# Altium schematic sheet TOP_VOLTAGE.SchDoc
size A3
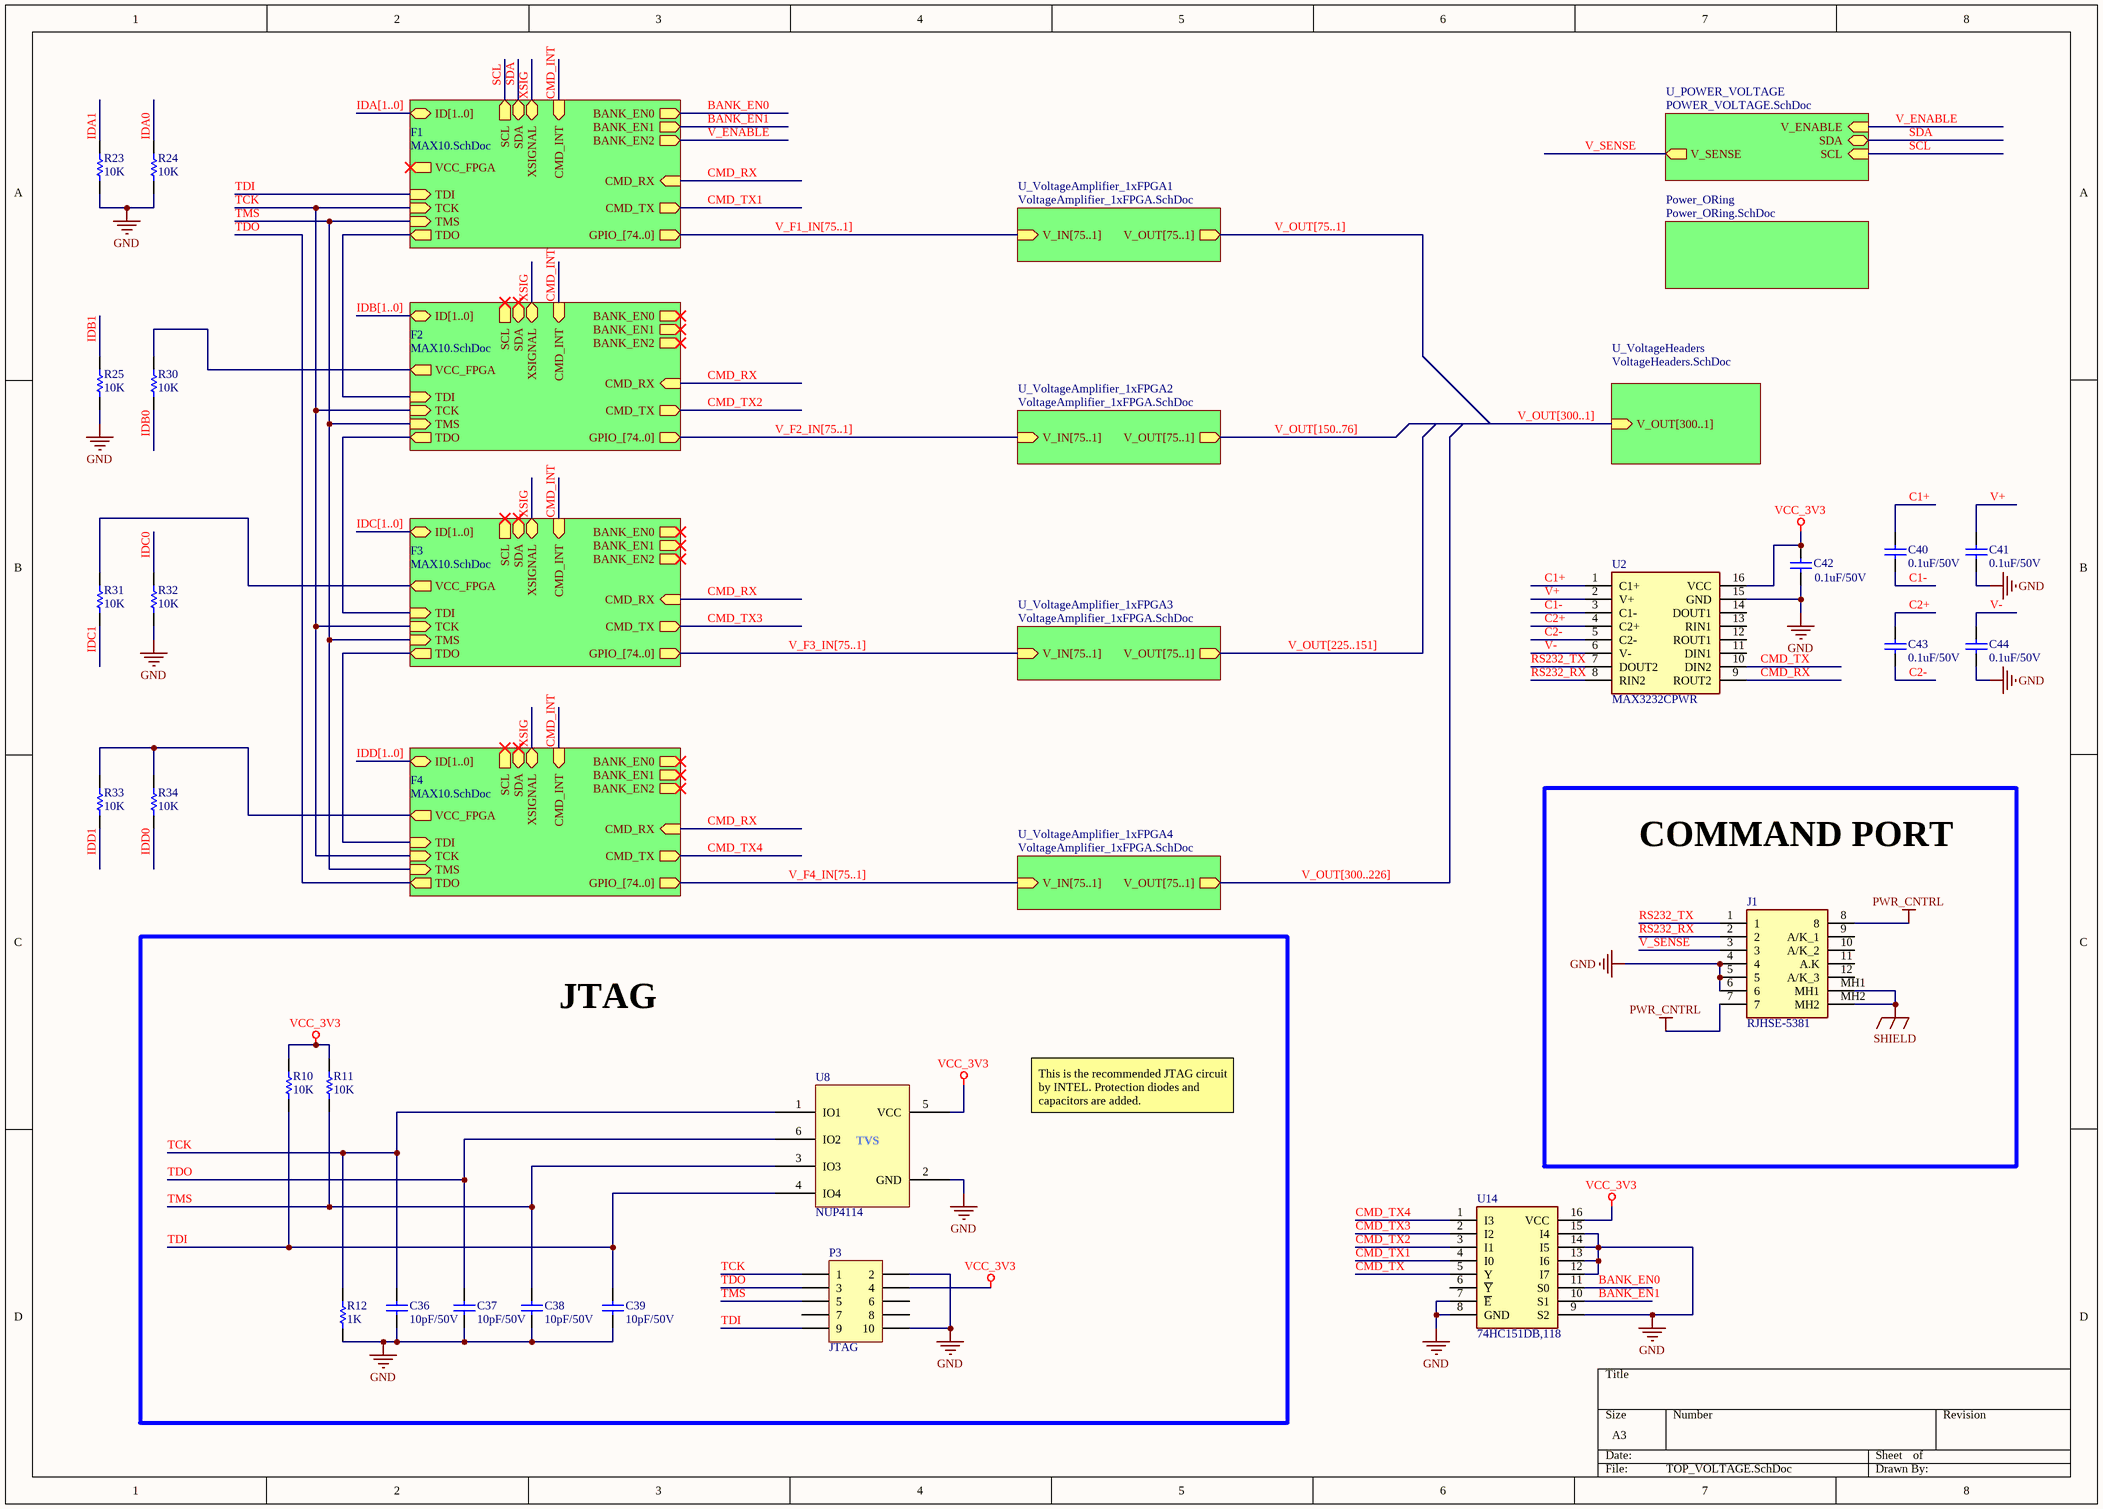
[diagram p0: TOP_VOLTAGE.SchDoc]

## Parts
C36  10pF/50V  [0603C]
C37  10pF/50V  [0603C]
C38  10pF/50V  [0603C]
C39  10pF/50V  [0603C]
C40  0.1uF/50V  [0603C]
C41  0.1uF/50V  [0603C]
C42  0.1uF/50V  [0603C]
C43  0.1uF/50V  [0603C]
C44  0.1uF/50V  [0603C]
J1  RJHSE-5381  [RJHSE5381]
P3  JTAG  [HDR2X5]  (no BOM)
R10  10K  [0603R]
R11  10K  [0603R]
R12  1K  [0603R]
R23  10K  [0603R]
R24  10K  [0603R]
R25  10K  [0603R]
R30  10K  [0603R]
R31  10K  [0603R]
R32  10K  [0603R]
R33  10K  [0603R]
R34  10K  [0603R]
U2  MAX3232CPWR  [MAX3232CPWR]
U8  NUP4114  [NUP4114HMR6T1G]
U14  74HC151DB,118  [74HC151DB,118]

## Blocks framed on the sheet
COMMAND PORT: J1
JTAG: C36-C39 P3 R10-R12 U8

## Sub-sheets
F1 = MAX10.SchDoc: TDI (in), TCK (in), TMS (in), TDO (out), CMD_RX (in), CMD_TX (out), SDA (bidir), CMD_INT (in), BANK_EN2 (out), GPIO_[74..0] (out), XSIGNAL (bidir), SCL (out), BANK_EN0 (out), BANK_EN1 (out), ID[1..0] (bidir), VCC_FPGA (out)
F2 = MAX10.SchDoc: TDI (in), TCK (in), TMS (in), TDO (out), CMD_RX (in), CMD_TX (out), SDA (bidir), CMD_INT (in), BANK_EN2 (out), GPIO_[74..0] (out), XSIGNAL (bidir), SCL (out), BANK_EN0 (out), BANK_EN1 (out), ID[1..0] (bidir), VCC_FPGA (out)
F3 = MAX10.SchDoc: TDI (in), TCK (in), TMS (in), TDO (out), CMD_RX (in), CMD_TX (out), SDA (bidir), CMD_INT (in), BANK_EN2 (out), GPIO_[74..0] (out), XSIGNAL (bidir), SCL (out), BANK_EN0 (out), BANK_EN1 (out), ID[1..0] (bidir), VCC_FPGA (out)
F4 = MAX10.SchDoc: TDI (in), TCK (in), TMS (in), TDO (out), CMD_RX (in), CMD_TX (out), SDA (bidir), CMD_INT (in), BANK_EN2 (out), GPIO_[74..0] (out), XSIGNAL (bidir), SCL (out), BANK_EN0 (out), BANK_EN1 (out), ID[1..0] (bidir), VCC_FPGA (out)
Power_ORing = Power_ORing.SchDoc: no entries
U_POWER_VOLTAGE = POWER_VOLTAGE.SchDoc: V_SENSE (out), V_ENABLE (in), SDA (bidir), SCL (in)
U_VoltageAmplifier_1xFPGA1 = VoltageAmplifier_1xFPGA.SchDoc: V_IN[75..1] (in), V_OUT[75..1] (out)
U_VoltageAmplifier_1xFPGA2 = VoltageAmplifier_1xFPGA.SchDoc: V_IN[75..1] (in), V_OUT[75..1] (out)
U_VoltageAmplifier_1xFPGA3 = VoltageAmplifier_1xFPGA.SchDoc: V_IN[75..1] (in), V_OUT[75..1] (out)
U_VoltageAmplifier_1xFPGA4 = VoltageAmplifier_1xFPGA.SchDoc: V_IN[75..1] (in), V_OUT[75..1] (out)
U_VoltageHeaders = VoltageHeaders.SchDoc: V_OUT[300..1] (in)

## Nets
GND: C36.1 C37.1 C38.1 C39.1 C41.1 C42.1 C44.1 J1.4 J1.5 J1.6 P3.2 P3.10 R12.1 R23.2 R24.2 R25.2 R32.2 U2.15(GND) U8.2(GND) U14.7(~{E}) U14.8(GND) U14.9(S2) U14.12(I7) U14.13(I6) U14.14(I5) U14.15(I4)
PWR_CNTRL: J1.7 J1.8
SHIELD: J1.MH1 J1.MH2
VCC_3V3: C42.2 P3.4 R10.1 R11.1 U2.16(VCC) U8.5(VCC) U14.16(VCC)
BANK_EN0: U14.11(S0) ; sheet F1/BANK_EN0
BANK_EN1: U14.10(S1) ; sheet F1/BANK_EN1
C1+: C40.2 U2.1(C1+)
C1-: C40.1 U2.3(C1-)
C2+: C43.2 U2.4(C2+)
C2-: C43.1 U2.5(C2-)
CMD_INT: sheet F1/CMD_INT, sheet F2/CMD_INT, sheet F3/CMD_INT, sheet F4/CMD_INT
CMD_RX: U2.9(ROUT2) ; sheet F1/CMD_RX, sheet F2/CMD_RX, sheet F3/CMD_RX, sheet F4/CMD_RX
CMD_TX: U2.10(DIN2) U14.5(Y)
CMD_TX1: U14.4(I0) ; sheet F1/CMD_TX
CMD_TX2: U14.3(I1) ; sheet F2/CMD_TX
CMD_TX3: U14.2(I2) ; sheet F3/CMD_TX
CMD_TX4: U14.1(I3) ; sheet F4/CMD_TX
IDA0: R24.1
IDA1: R23.1
IDB0: R30.2
IDB1: R25.1
IDC0: R32.1
IDC1: R31.2
IDD0: R34.2
IDD1: R33.2
RS232_RX: J1.2 U2.8(RIN2)
RS232_TX: J1.1 U2.7(DOUT2)
SCL: sheet F1/SCL, sheet U_POWER_VOLTAGE/SCL
SDA: sheet F1/SDA, sheet U_POWER_VOLTAGE/SDA
TCK: C36.2 P3.1 R12.2 U8.1(IO1) ; sheet F1/TCK, sheet F2/TCK, sheet F3/TCK, sheet F4/TCK
TDI: C39.2 P3.9 R10.2 U8.4(IO4) ; sheet F1/TDI
TDO: C37.2 P3.3 U8.6(IO2) ; sheet F4/TDO
TMS: C38.2 P3.5 R11.2 U8.3(IO3) ; sheet F1/TMS, sheet F2/TMS, sheet F3/TMS, sheet F4/TMS
V+: C41.2 U2.2(V+)
V-: C44.2 U2.6(V-)
V_ENABLE: sheet F1/BANK_EN2, sheet U_POWER_VOLTAGE/V_ENABLE
V_SENSE: J1.3 ; sheet U_POWER_VOLTAGE/V_SENSE
XSIG: sheet F1/XSIGNAL, sheet F2/XSIGNAL, sheet F3/XSIGNAL, sheet F4/XSIGNAL
NetR30_1: R30.1 ; sheet F2/VCC_FPGA
NetR31_1: R31.1 ; sheet F3/VCC_FPGA
NetR33_1: R33.1 R34.1 ; sheet F4/VCC_FPGA
(unnamed): sheet F1/TDO, sheet F2/TDI
(unnamed): sheet F2/TDO, sheet F3/TDI
(unnamed): sheet F3/TDO, sheet F4/TDI

Not connected (* = marked no-connect by the designer): J1 9(A/K_1) 10(A/K_2) 11(A.K) 12(A/K_3); P3 6 7 8; U2 11(DIN1) 12(ROUT1) 13(RIN1) 14(DOUT1); U14 6(~{Y})

## Buses and harness runs
bus IDA[1..0] = sheet F1/ID[1..0]
bus IDB[1..0] = sheet F2/ID[1..0]
bus IDC[1..0] = sheet F3/ID[1..0]
bus IDD[1..0] = sheet F4/ID[1..0]
bus V_F1_IN[75..1] = sheet F1/GPIO_[74..0] = sheet U_VoltageAmplifier_1xFPGA1/V_IN[75..1]
bus V_F2_IN[75..1] = sheet F2/GPIO_[74..0] = sheet U_VoltageAmplifier_1xFPGA2/V_IN[75..1]
bus V_F3_IN[75..1] = sheet F3/GPIO_[74..0] = sheet U_VoltageAmplifier_1xFPGA3/V_IN[75..1]
bus V_F4_IN[75..1] = sheet F4/GPIO_[74..0] = sheet U_VoltageAmplifier_1xFPGA4/V_IN[75..1]
bus V_OUT[75..1] = sheet U_VoltageAmplifier_1xFPGA1/V_OUT[75..1]
bus V_OUT[150..76] = sheet U_VoltageAmplifier_1xFPGA2/V_OUT[75..1]
bus V_OUT[225..151] = sheet U_VoltageAmplifier_1xFPGA3/V_OUT[75..1]
bus V_OUT[300..1] = sheet U_VoltageHeaders/V_OUT[300..1]
bus V_OUT[300..226] = sheet U_VoltageAmplifier_1xFPGA4/V_OUT[75..1]

## Notes on the sheet
- This is the recommended JTAG circuit by INTEL. Protection diodes and capacitors are added.

## Library data of the parts
C36-C39 = Cap: Multilayer Ceramic Capacitors MLCC - SMD/SMT 50V 10pF 0603 C0G 5% AEC-Q200; Mfr: KEMET; Mfr Part No: C0603C100J5GACAUTO; Package: 0603; Price: 0.192; Stockiest: MOUSER; Stockiest Part No: 80-C0603C100J5GAUTO; Value: 10pF/50V
C40-C44 = Cap: Multilayer Ceramic Capacitors MLCC - SMD/SMT 50V 0.1uF 0603 X7R 20%; Mfr: KEMET; Mfr Part No: C0603C104M5RACTU; Package: 0603; Price: 0.101; Stockiest: MOUSER; Stockiest Part No: 80-C0603C104M5R; Value: 0.1uF/50V
J1 = RJHSE-5381: Modular Connectors / Ethernet Connectors R/A RJ45 SHEILDED 8 CONT Y/G LEDS; Mfr: Amphenol Commercial Products; Mfr Part No: RJHSE-5381; Price: 1.77; Stockiest: MOUSER; Stockiest Part No: 523-RJHSE-5381
P3 = Header 5X2: Header, 5-Pin, Dual row; Stockiest: MOUSER
R10 R11 R23-R25 R30-R34 = Res1: Thick Film Resistors - SMD 0603 10Kohms 1% Anti-Sulfur AEC-Q200; Mfr: ROHM Semiconductor; Mfr Part No: SFR03EZPF1002; Package: 0603; Price: 0.101; Stockiest: MOUSER; Stockiest Part No: 755-SFR03EZPF1002; Value: 10K
R12 = Res1: Resistor; Mfr: Vishay / Dale; Mfr Part No: CRCW06031K00FKEAC; Package: 0603; Price: 0.1; Stockiest: MOUSER; Stockiest Part No: 71-CRCW06031K00FKEAC; Value: 1K
U2 = MAX3232CPWR: RS-232 Interface IC 3-5.5V Mult-Ch RS232; Mfr: Texas Instruments; Mfr Part No: MAX3232CPWR; Price: 0.94; Stockiest: MOUSER; Stockiest Part No: 595-MAX3232CPWR
U8 = NUP4114: ESD Suppressors / TVS Diodes LOW CAP TVS ARRAY 5.5V; Mfr: ON SEMI; Mfr Part No: NUP4114HMR6T1G; Price: 0.534; Stockiest: MOUSER; Stockiest Part No: 863-NUP4114HMR6T1G; Value: TVS
U14 = 74HC151DB,118: Encoders, Decoders, Multiplexers & Demultiplexers 8-INPUT MULTIPLEXER; Mfr: NEXPERIA; Mfr Part No: 74HC151DB,118; Price: 0.887; Stockiest: MOUSER; Stockiest Part No: 771-HC151DB118